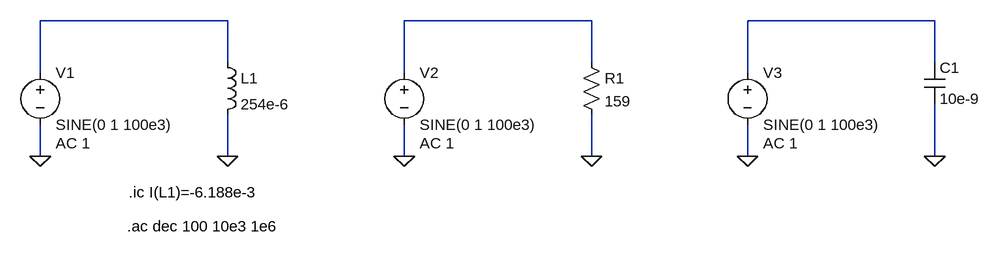
[diagram p0: schematic Impedance Pt2.asc]
Impedance Pt2.asc, the LTspice schematic file:
Version 4
SHEET 1 2688 680
WIRE 304 48 16 48
WIRE 864 48 576 48
WIRE 1392 48 1104 48
WIRE 304 112 304 48
WIRE 864 112 864 48
WIRE 1392 112 1392 48
WIRE 16 128 16 48
WIRE 576 128 576 48
WIRE 1104 128 1104 48
WIRE 16 256 16 208
WIRE 304 256 304 192
WIRE 576 256 576 208
WIRE 864 256 864 192
WIRE 1104 256 1104 208
WIRE 1392 256 1392 176
FLAG 16 256 0
FLAG 304 256 0
FLAG 576 256 0
FLAG 864 256 0
FLAG 1104 256 0
FLAG 1392 256 0
SYMBOL voltage 16 112 R0
WINDOW 123 24 124 Left 2
WINDOW 39 0 0 Left 0
SYMATTR Value2 AC 1
SYMATTR InstName V1
SYMATTR Value SINE(0 1 100e3)
SYMBOL ind 288 96 R0
SYMATTR InstName L1
SYMATTR Value 254e-6
SYMBOL voltage 576 112 R0
WINDOW 123 24 124 Left 2
WINDOW 39 0 0 Left 0
SYMATTR Value2 AC 1
SYMATTR InstName V2
SYMATTR Value SINE(0 1 100e3)
SYMBOL voltage 1104 112 R0
WINDOW 123 24 124 Left 2
WINDOW 39 0 0 Left 0
SYMATTR Value2 AC 1
SYMATTR InstName V3
SYMATTR Value SINE(0 1 100e3)
SYMBOL res 848 96 R0
SYMATTR InstName R1
SYMATTR Value 159
SYMBOL cap 1376 112 R0
SYMATTR InstName C1
SYMATTR Value 10e-9
TEXT 152 312 Left 2 !.ic I(L1)=-6.188e-3
TEXT 150 364 Left 2 !.ac dec 100 10e3 1e6

The netlist it stands for:
* Impedance Pt2.asc
V1 N001 0 SINE(0 1 100e3) AC 1
L1 N001 0 254e-6
V2 N002 0 SINE(0 1 100e3) AC 1
V3 N003 0 SINE(0 1 100e3) AC 1
R1 N002 0 159
C1 N003 0 10e-9
.ic I(L1)=-6.188e-3
.ac dec 100 10e3 1e6
.backanno
.end